# Altium schematic sheet sz.1.SchDoc
size A4
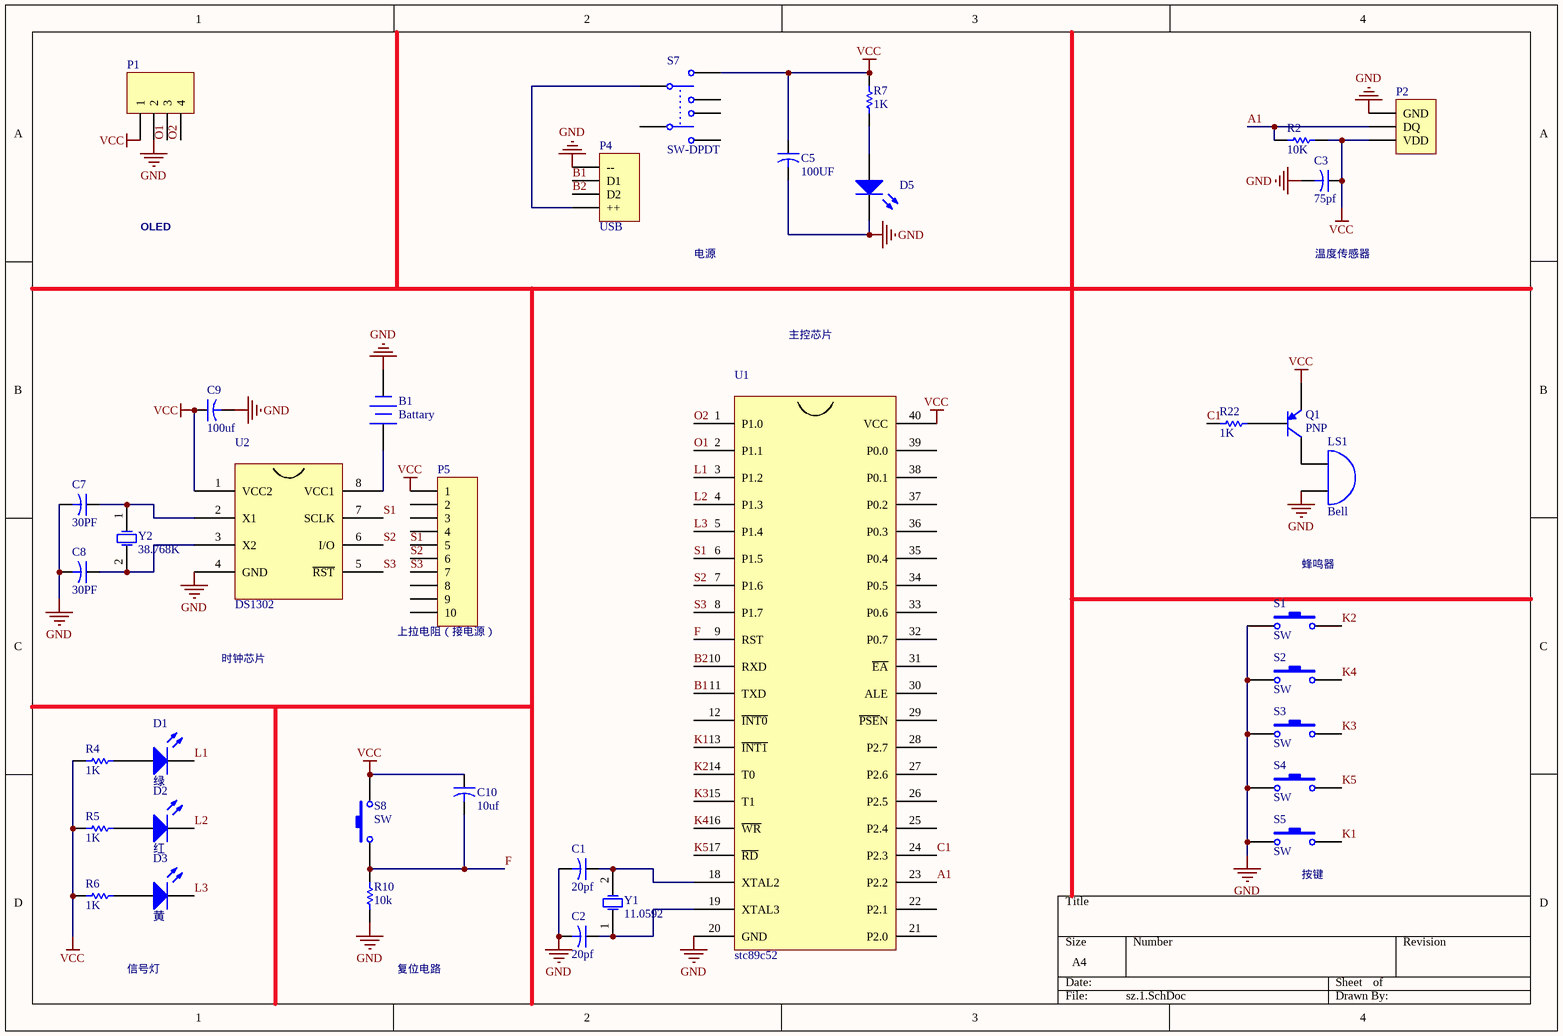
[diagram p0: sz.1.SchDoc]

## Parts
B1  Battary  [Battary]
C1  20pf  [CAPR5-4X5]
C2  20pf  [CAPR5-4X5]
C3  75pf  [CAPR5-4X5]
C5  100UF  [CAPR5-4X5]
C7  30PF  [CAPR5-4X5]
C8  30PF  [CAPR5-4X5]
C9  100uf  [CAPR5-4X5]
C10  10uf  [CAPR5-4X5]
D1  绿  [LED-1]
D2  红  [LED-1]
D3  黄  [LED-1]
D5  LED1  [LED-1]  (value not drawn)
LS1  Bell  [bell]
P1  OLED  [HDR1X4]  (value not drawn)
P2  Header 3  [HDR1X3]  (value not drawn)
P4  USB  [HDR1X4]
P5  (no value)  [HDR1X10]
Q1  PNP  [PNP]
R2  10K  [AXIAL-0.3]
R4  1K  [AXIAL-0.3]
R5  1K  [AXIAL-0.3]
R6  1K  [AXIAL-0.3]
R7  1K  [AXIAL-0.3]
R10  10k  [AXIAL-0.3]
R22  1K  [AXIAL-0.3]
S1  SW  [SW]
S2  SW  [SW]
S3  SW  [SW]
S4  SW  [SW]
S5  SW  [SW]
S7  SW-DPDT  [DPDT-6]
S8  SW  [SW]
U1  stc89c52  [stc89c52]
U2  DS1302  [DS1302]
Y1  11.0592  [XTAL]
Y2  38.768K  [XTAL]

## Nets
GND: B1.2(-) C1.2 C2.2 C3.2 C5.2 C7.2 C8.2 C9.2 D5.2(K) LS1.2(B) P1.2 P2.1(GND) P4.1(--) R10.1 S1.1 S2.1 S3.1 S4.1 S5.1 U1.20(GND) U2.4(GND)
VCC: C3.1 C5.1 C9.1 C10.1 P1.1 P2.3(VDD) P5.1 Q1.3(E) R2.2 R4.1 R5.1 R6.1 R7.1 S7.2 S8.2 U1.40(VCC) U2.1(VCC2)
A1: P2.2(DQ) R2.1 U1.23(P2.2)
B1: P4.2(D1) U1.11(TXD)
B2: P4.3(D2) U1.10(RXD)
C1: R22.1 U1.24(P2.3)
F: C10.2 R10.2 S8.1 U1.9(RST)
K1: S5.2 U1.13(~{INT1})
K2: S1.2 U1.14(T0)
K3: S3.2 U1.15(T1)
K4: S2.2 U1.16(~{WR})
K5: S4.2 U1.17(~{RD})
L1: D1.2(K) U1.3(P1.2)
L2: D2.2(K) U1.4(P1.3)
L3: D3.2(K) U1.5(P1.4)
O1: P1.3 U1.2(P1.1)
O2: P1.4 U1.1(P1.0)
S1: P5.5 U1.6(P1.5) U2.7(SCLK)
S2: P5.6 U1.7(P1.6) U2.6(I/O)
S3: P5.7 U1.8(P1.7) U2.5(~{RST})
NetB1_1: B1.1(+) U2.8(VCC1)
NetC1_1: C1.1 U1.18(XTAL2) Y1.2(OSC2)
NetC2_1: C2.1 U1.19(XTAL3) Y1.1(OSC1)
NetC7_1: C7.1 U2.2(X1) Y2.1(OSC1)
NetC8_1: C8.1 U2.3(X2) Y2.2(OSC2)
NetD1_1: D1.1(A) R4.2
NetD2_1: D2.1(A) R5.2
NetD3_1: D3.1(A) R6.2
NetD5_1: D5.1(A) R7.2
NetLS1_1: LS1.1(A) Q1.1(C)
NetP4_4: P4.4(++) S7.1
NetQ1_2: Q1.2(B) R22.2

Not connected (* = marked no-connect by the designer): P5 2 3 4 8 9 10; S7 3 4 5 6; U1 12(~{INT0}) 21(P2.0) 22(P2.1) 25(P2.4) 26(P2.5) 27(P2.6) 28(P2.7) 29(~{PSE}N) 30(ALE) 31(~{EA}) 32(P0.7) 33(P0.6) 34(P0.5) 35(P0.4) 36(P0.3) 37(P0.2) 38(P0.1) 39(P0.0)

## Notes on the sheet
- OLED
- 电源
- 温度传感器
- 主控芯片
- 蜂鸣器
- (near P5) 上拉电阻（接电源）
- 时钟芯片
- (near S5) 按键
- 信号灯
- 复位电路

## Library data of the parts
C1 C2 = Cap2: Value: 100pF; Published: 23-Sep-2002; PackageReference: CAPR5-4X5; Publisher: Altium Limited; PackageDescription: Capacitor; 2 Leads
C3 C5 C7-C10 = Cap2: Capacitor; Value: 100pF; Published: 23-Sep-2002; PackageReference: CAPR5-4X5; Publisher: Altium Limited; PackageDescription: Capacitor; 2 Leads
D1-D3 D5 = LED1: Typical RED GaAs LED; Published: 8-Jun-2000; LatestRevisionDate: 08-Jul-2005; LatestRevisionNote: Mech Layer 1 removed.; PackageReference: LED-1; Publisher: Altium Limited; PackageDescription: LED; 2 Leads
P1 P4 = Header 4: Header, 4-Pin; LatestRevisionDate: 17-Jul-2002; LatestRevisionNote: Re-released for DXP Platform.; Publisher: Altium Limited
P2 = Header 3: Header, 3-Pin; LatestRevisionDate: 17-Jul-2002; LatestRevisionNote: Re-released for DXP Platform.; Publisher: Altium Limited
P5 = Header 10: Header, 10-Pin; LatestRevisionDate: 17-Jul-2002; LatestRevisionNote: Re-released for DXP Platform.; Publisher: Altium Limited
R2 R10 = Res1: Resistor; Value: 1K; Published: 8-Jun-2000; LatestRevisionDate: 17-Jul-2002; LatestRevisionNote: Re-released for DXP Platform.; PackageReference: AXIAL-0.3; Publisher: Altium Limited; PackageDescription: Axial Device, Thru-Hole; 2 Leads; 0.3 in Pin Spacing
R4-R7 R22 = Res1: Resistor; Published: 8-Jun-2000; LatestRevisionDate: 17-Jul-2002; LatestRevisionNote: Re-released for DXP Platform.; PackageReference: AXIAL-0.3; Publisher: Altium Limited; PackageDescription: Axial Device, Thru-Hole; 2 Leads; 0.3 in Pin Spacing; Value: 1K
S7 = SW-DPDT: Double-Pole, Double-Throw Switch; Published: 24-Mar-1999; LatestRevisionDate: 17-Jul-2002; LatestRevisionNote: Re-released for DXP Platform.; PackageReference: DPDT-6; Publisher: Altium Limited; PackageDescription: Switch; 6 Leads
Y1 Y2 = XTAL